# EAGLE design TMR01_v3 (EAGLE 9.2.2)
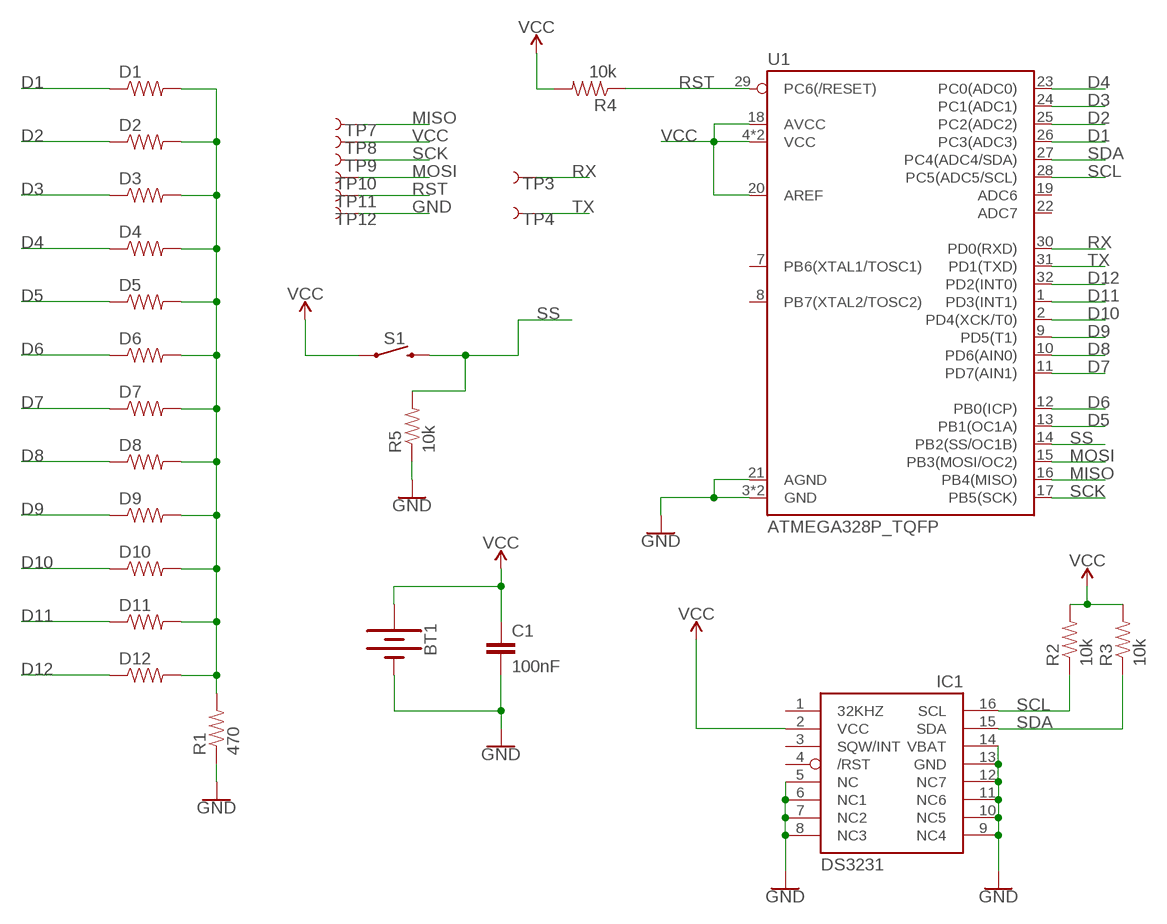
[diagram p0: schematic, sheet 1]

## Parts
BT1  BATTERY-20MM_SMD_4LEGS  [BATTCON_20MM_4LEGS]
C1  100nF  CAP_0402  [0402]
D1  RES_0402  [0402]
D2  RES_0402  [0402]
D3  RES_0402  [0402]
D4  RES_0402  [0402]
D5  RES_0402  [0402]
D6  RES_0402  [0402]
D7  RES_0402  [0402]
D8  RES_0402  [0402]
D9  RES_0402  [0402]
D10  RES_0402  [0402]
D11  RES_0402  [0402]
D12  RES_0402  [0402]
IC1  DS3231/SO  [SO16W]
R1  470  RES_0402  [0402]
R2  10k  RES_0402  [0402]
R3  10k  RES_0402  [0402]
R4  10k  RES_0402  [0402]
R5  10k  RES_0402  [0402]
S1  MOMENTARY-SWITCH-SPST  [TACTILE_SWITCH_PTH_2_AHE]
TP3  TEST-POINT3X4  [PAD.03X.04]
TP4  TEST-POINT3X4  [PAD.03X.04]
TP7  TEST-POINT3X4  [PAD.03X.04]
TP8  TEST-POINT3X4  [PAD.03X.04]
TP9  TEST-POINT3X4  [PAD.03X.04]
TP10  TEST-POINT3X4  [PAD.03X.04]
TP11  TEST-POINT3X4  [PAD.03X.04]
TP12  TEST-POINT3X4  [PAD.03X.04]
U1  ATMEGA328P_TQFP  [TQFP32-08]

## Nets
D1: D1.1 U1.26(PC3(ADC3))
D2: D2.1 U1.25(PC2(ADC2))
D3: D3.1 U1.24(PC1(ADC1))
D4: D4.1 U1.23(PC0(ADC0))
D5: D5.1 U1.13(PB1(OC1A))
D6: D6.1 U1.12(PB0(ICP))
D7: D7.1 U1.11(PD7(AIN1))
D8: D8.1 U1.10(PD6(AIN0))
D9: D9.1 U1.9(PD5(T1))
D10: D10.1 U1.2(PD4(XCK/T0))
D11: D11.1 U1.1(PD3(INT1))
D12: D12.1 U1.32(PD2(INT0))
GND: BT1.NEGATIVE(-) C1.2 IC1.5(NC) IC1.6(NC1) IC1.7(NC2) IC1.8(NC3) IC1.9(NC4) IC1.10(NC5) IC1.11(NC6) IC1.12(NC7) IC1.13(GND) IC1.14(VBAT) R1.1 R5.1 TP12.P$1 U1.3(GND) U1.5(GND) U1.21(AGND)
MISO: TP7.P$1 U1.16(PB4(MISO))
MOSI: TP10.P$1 U1.15(PB3(MOSI/OC2))
N$3: D1.2 D2.2 D3.2 D4.2 D5.2 D6.2 D7.2 D8.2 D9.2 D10.2 D11.2 D12.2 R1.2
RST: R4.1 TP11.P$1 U1.29(PC6(/RESET))
RX: TP3.P$1 U1.30(PD0(RXD))
SCK: TP9.P$1 U1.17(PB5(SCK))
SCL: IC1.16(SCL) R2.1 U1.28(PC5(ADC5/SCL))
SDA: IC1.15(SDA) R3.1 U1.27(PC4(ADC4/SDA))
SS: R5.2 S1.2 U1.14(PB2(SS/OC1B))
TX: TP4.P$1 U1.31(PD1(TXD))
VCC: BT1.POSITIVE@1(+) BT1.POSITIVE@2(+) BT1.POSITIVE@3(+) BT1.POSITIVE@4(+) C1.1 IC1.2(VCC) R2.2 R3.2 R4.2 S1.1 TP8.P$1 U1.4(VCC) U1.6(VCC) U1.18(AVCC) U1.20(AREF)
Unconnected: IC1.1(32KHZ) IC1.3(SQW/INT) IC1.4(/RST) U1.7(PB6(XTAL1/TOSC1)) U1.8(PB7(XTAL2/TOSC2)) U1.19(ADC6) U1.22(ADC7)

## Library data of the parts
BT1 = SparkFun-Batteries:BATTERY: Battery - Single Cell A variety of battery chemistries, sizes, and footprints. Device List: 20MM_PTH - Coin Cell Battery Holder - 20mm (PTH) <https://www.sparkfun.com/products/783> 20MM_PTH_KIT- Coin Cell battery Holder - 20 mm (PTH) <http://www.sparkfun.com/products/783>kit version with special mask 6.8MM_PTH - Coin Cell Battery Holder - 6.8MM(SMD) <https://www.digikey.com/product-detail/en/seiko-instruments/MS621FE-FL11E/728-1057-ND/1889208?WT.srch=1&gclid=CNOQ5a6LzdQCFZS2wAodXCkE0g> 12MM_SMD - Coin Cell Battery Holder - 12mm (SMD) <https://www.sparkfun.com/products/10592> 12MM_PTH - Coin Cell Battery Holder - 12mm (PTH) <https://www.sparkfun.com/products/7948> 20MM_SMD - 20mm Coin Cell Battery Holder (SMD) (2 legs) Used on the Big Time Watch Kit <https://www.sparkfun.com/products/11734> 20MM_SMD_4LEGS - Coin Cell Battery Holder - 20mm (SMD) <https://www.sparkfun.com/products/11892> 20MM_SMD_4LEGS_OVERPASTE - Coin Cell Battery Holder - 20mm (SMD) <https://www.sparkfun.com/products/11892> (Over-paste on the legs) 24.5MM_PTH - Coin Cell Battery Holder - 24.5mm (PTH) <https://www.sparkfun.com/products/8863> 9V - 9V Battery Holder - PC Mount Used on the SparkFun SparkPunk Sound Kit <https://www.sparkfun.com/products/11177> and SparkFun SparkPunk Sequencer Kit <https://www.sparkfun.com/products/12707> 18650 - Battery Holder - 18650 (PTH) <https://www.sparkfun.com/products/13113> AA - Battery Holder - 1xAA (PTH) <https://www.sparkfun.com/products/7949> AAA - Battery Holder - 1xAAA (PTH) <https://www.sparkfun.com/products/12718> AA_KIT - Battery Holder - 1xAA (PTH) <https://www.sparkfun.com/products/7949> Special kit package - pads only have exposed copper on one side of the board. AAA_KIT - Battery Holder - 1xAAA (PTH) <https://www.sparkfun.com/products/12718> Special kit package - pads only have exposed copper on one side of the board.; PROD_ID: BATT-10373; SF_SKU: PRT-11892
C1 = Perfect_0402:CAP_0402: 0402 (1005 Metric) Nick Garner - TeleSense
D1-D12 R1-R5 = Perfect_0402:RES_0402: 0402 (1005 Metric) Nick Garner - TeleSense
IC1 = adafruit:DS3231
S1 = SparkFun-Switches:MOMENTARY-SWITCH-SPST: Momentary Switch (Pushbutton) - SPST Normally-open (NO) SPST momentary switches (buttons, pushbuttons). Variants PTH-12MM - 12mm square, through-hole Momentary Pushbutton Switch - 12mm Square <https://www.sparkfun.com/products/9190> (COM-09190) PTH-6.0MM, PTH-6.0MM-KIT - 6.0mm square, through-hole Mini Pushbutton Switch <https://www.sparkfun.com/products/97> (COM-00097) KIT package intended for soldering kit's - only one side of pads' copper is exposed. PTH-RIGHT-ANGLE-KIT - Right-angle, through-hole Right Angle Tactile Button <https://www.sparkfun.com/products/10791> - Used on SparkFun BigTime Watch Kit <https://www.sparkfun.com/products/11734> SMD-12MM - 12mm square, surface-mount Tactile Button - SMD (12mm) <https://www.sparkfun.com/products/12993> (COM-12993) Used on SparkFun PicoBoard <https://www.sparkfun.com/products/11888> SMD-4.5MM - 4.5mm Square Trackball Switch Used on SparkFun Blackberry Trackballer Breakout <https://www.sparkfun.com/products/13169> SMD-4.6MMX2.8MM - 4.60mm x 2.80mm, surface mount Used on SparkFun SAMD21 Mini Breakout <https://www.sparkfun.com/products/13664> SMD-5.2MM, SMD-5.2-REDUNDANT - 5.2mm square, surface-mount Mini Pushbutton Switch - SMD <https://www.sparkfun.com/products/8720> (COM-08720) Used on Arduino Pro Mini <https://www.sparkfun.com/products/11114> REDUNDANT package connects both switch circuits together SMD-6.0X3.5MM - 6.0 x 3.5mm, surface mount Momentary Reset Switch SMD <https://www.sparkfun.com/products/8229> (COM-08229) SMD-6.2MM-TALL - 6.2mm square, surface mount Tactile Button - SMD (6mm) <https://www.sparkfun.com/products/12992> Used on SparkFun Digital Sandbox <https://www.sparkfun.com/products/12651> SMD-RIGHT-ANGLE - Right-angle, surface mount Used on SparkFun Block for Intel® Edison - Arduino <https://www.sparkfun.com/products/13036>
TP3 TP4 TP7-TP12 = SparkFun-Connectors:TEST-POINT: SparkFun Test Points Bare copper test points for troubleshooting or In-Circuit-Testing. These are used by our Production team for verifying production board runs using pogo-pins on test beds. SparkFun Products: SparkFun LSM9DS1 Breakout <https://www.sparkfun.com/products/13284> SparkFun PSOC <https://www.sparkfun.com/products/13714> SparkFun Load Cell Amplifier <https://www.sparkfun.com/products/13879>
U1 = SparkFun-IC-Microcontroller:ATMEGA328P_TQFP: Popular 328P in QFP Storefront component: ATmega328 - TQFP <https://www.sparkfun.com/products/13448> (COM-13448) Datasheet <http://www.sparkfun.com/datasheets/Components/SMD/ATMega328.pdf> SparkFun Products SparkFun RedBoard - Programmed with Arduino <https://www.sparkfun.com/products/12757> (DEV-12757) Arduino Pro Mini 328 - 5V/16MHz <https://www.sparkfun.com/products/11113> (DEV-11113) Arduino Pro Mini 328 - 3.3V/8MHz <https://www.sparkfun.com/products/11114> (DEV-11114) SparkFun OpenLog <https://www.sparkfun.com/products/13712> (DEV-13712) SparkFun MicroView - OLED Arduino Module <https://www.sparkfun.com/products/12923> (DEV-12923) SparkFun Digital Sandbox <https://www.sparkfun.com/products/12651> (DEV-12651) SparkFun PicoBoard <https://www.sparkfun.com/products/11888> (WIG-11888) Arduino Fio <https://www.sparkfun.com/products/10116> (DEV-10116) LilyPad Arduino 328 Main Board <https://www.sparkfun.com/products/13342> (DEV-13342) SparkFun RedStick <https://www.sparkfun.com/products/13741> (DEV-13741) LilyPad MP3 <https://www.sparkfun.com/products/11013> (DEV-11013) LilyPad Arduino SimpleSnap <https://www.sparkfun.com/products/10941> (DEV-10941) SparkFun Stepoko <https://www.sparkfun.com/products/13899> (ROB-13899) SparkFun Geiger Counter <https://www.sparkfun.com/products/11345> (SEN-11345) SparkFun EL Sequencer <https://www.sparkfun.com/products/12781> (COM-12781) Arduino Pro 328 - 5V/16MHz <https://www.sparkfun.com/products/10915> (DEV-10915) CryptoCape <https://www.sparkfun.com/products/12773> (DEV-12773) SparkFun IR Thermometer Evaluation Board - MLX90614 <https://www.sparkfun.com/products/10740> (SEN-10740) SparkFun RedBot Mainboard <https://www.sparkfun.com/products/12097> (ROB-12097) Arduino Pro 328 - 3.3V/8MHz <https://www.sparkfun.com/products/10914> (DEV-10914) SparkFun Block for Intel® Edison - Arduino <https://www.sparkfun.com/products/13036> (DEV-13036) SparkFun Simon Says - Surface Mount Soldering Kit <https://www.sparkfun.com/products/10935> (KIT-10935) SparkFun 7-Segment Serial Display - Red <https://www.sparkfun.com/products/11441> (COM-11441) SparkFun 7-Segment Serial Display - White <https://www.sparkfun.com/products/11629> (COM-11629) SparkFun 7-Segment Serial Display - Yellow <https://www.sparkfun.com/products/11443> (COM-11443) SparkFun 7-Segment Serial Display - Kelly Green <https://www.sparkfun.com/products/11440> (COM-11440) SparkFun 7-Segment Serial Display - Blue <https://www.sparkfun.com/products/11442> (COM-11442) SparkFun OpenSegment Serial Display - 20mm (Blue) <https://www.sparkfun.com/products/11647> (COM-11647) SparkFun OpenSegment Serial Display - 20mm (Green) <https://www.sparkfun.com/products/11646> (COM-11646) SparkFun OpenSegment Serial Display - 20mm (White) <https://www.sparkfun.com/products/11648> (COM-11648) SparkFun OpenSegment Serial Display - 20mm (Red) <https://www.sparkfun.com/products/11644> (COM-11644) SparkFun OpenSegment Serial Display - 20mm (Yellow) <https://www.sparkfun.com/products/11645> (COM-11645) SparkFun OpenSegment Shield <https://www.sparkfun.com/products/13190> (DEV-13190); PROD_ID: IC-09069

## Board
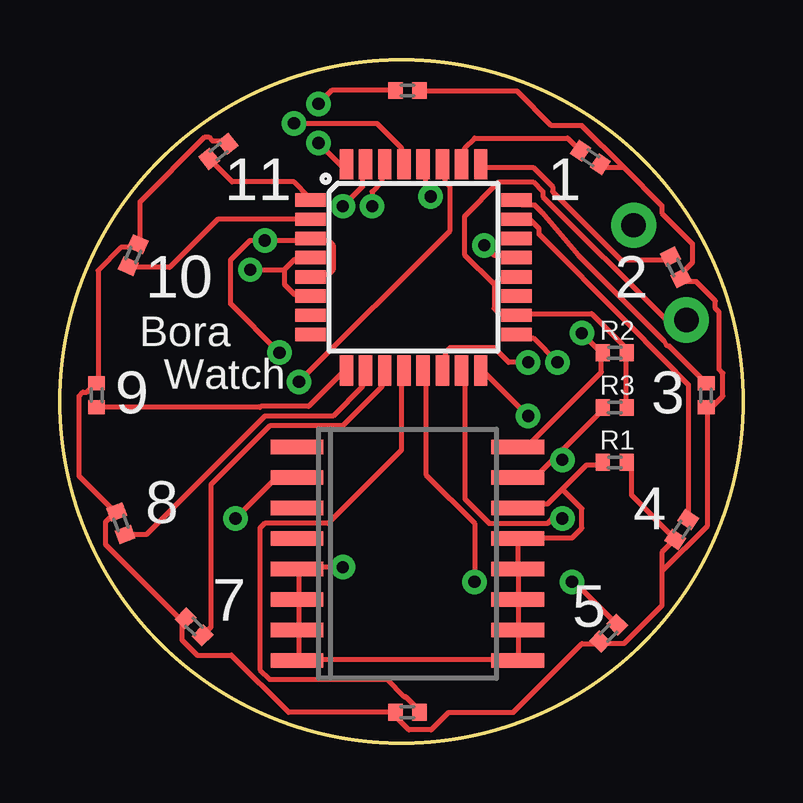
[diagram p1: board, top side]
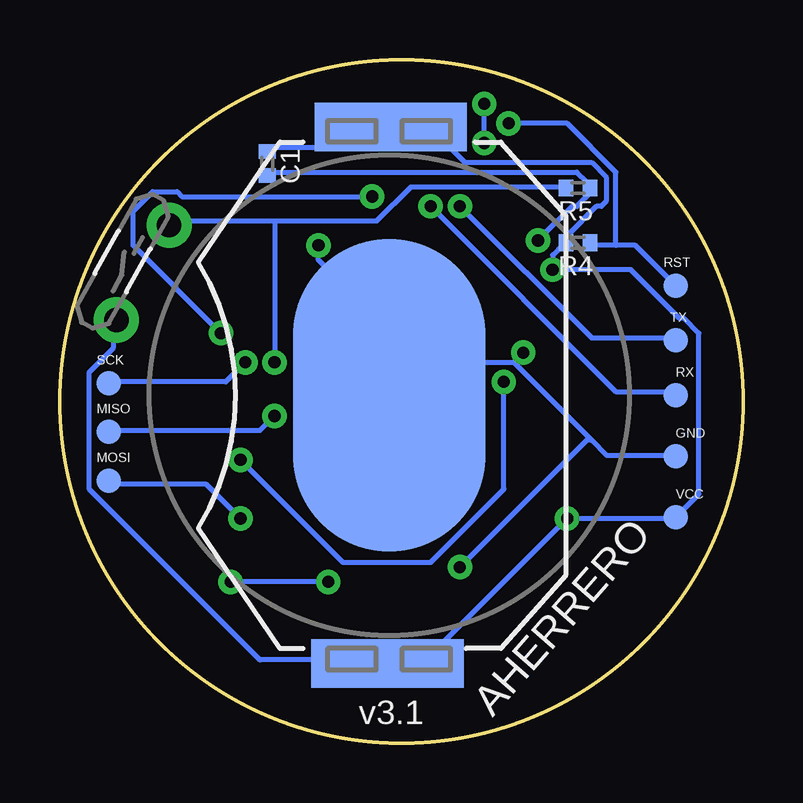
[diagram p2: board, bottom side, seen from below]

Size 28.45 x 28.45 mm. Coordinates in mm from the lower left corner, seen from the top.
Outline: circle at 14.22,14.22 radius 14.22
Copper layers (1*16): Top 0.035mm / dielectric 1.5mm / Bottom 0.035mm
Design rules "SparkFun": minimum track width 8mil, minimum drill 20mil, track to track 8mil, track to pad 8mil, pad to pad 8mil, via to via 8mil, smd to smd 8mil, copper to edge 8mil, drill to drill 8mil, minimum pad ring 12mil, minimum via ring 10mil, stop-mask expansion 4mil, vias tented up to drill 20mil, thermal gap 10mil

### Footprints (pad centres in the part's own frame; a part is rotated, then mirrored left to right if it is on the bottom)
BATTCON_20MM_4LEGS = smd 13 x 8: NEGATIVE 0,0 | smd 2.032 x 3.175: POSITIVE@1 -11.176,1.651; POSITIVE@2 -11.176,-1.524; POSITIVE@3 11.176,1.524; POSITIVE@4 11.176,-1.651
0402 = smd 0.6 x 0.7: 1 -0.5,0; 2 0.5,0
SO16W = smd 0.6 x 2.2: 1 -4.445,-4.6; 2 -3.175,-4.6; 3 -1.905,-4.6; 4 -0.635,-4.6; 5 0.635,-4.6; 6 1.905,-4.6; 7 3.175,-4.6; 8 4.445,-4.6; 9 4.445,4.6; 10 3.175,4.6; 11 1.905,4.6; 12 0.635,4.6; 13 -0.635,4.6; 14 -1.905,4.6; 15 -3.175,4.6; 16 -4.445,4.6
TACTILE_SWITCH_PTH_2_AHE = drill 1.016 pad 1.88: 1 -0.457,2.261; 2 -0.457,-2.261
PAD.03X.04 = smd 1.016 x 1.016: P$1 0,0
TQFP32-08 = smd 1.27 x 0.559: 1 -4.293,2.8; 2 -4.293,2; 3 -4.293,1.2; 4 -4.293,0.4; 5 -4.293,-0.4; 6 -4.293,-1.2; 7 -4.293,-2; 8 -4.293,-2.8; 17 4.293,-2.8; 18 4.293,-2; 19 4.293,-1.2; 20 4.293,-0.4; 21 4.293,0.4; 22 4.293,1.2; 23 4.293,2; 24 4.293,2.8 | smd 0.559 x 1.27: 9 -2.8,-4.293; 10 -2,-4.293; 11 -1.2,-4.293; 12 -0.4,-4.293; 13 0.4,-4.293; 14 1.2,-4.293; 15 2,-4.293; 16 2.8,-4.293; 25 2.8,4.293; 26 2,4.293; 27 1.2,4.293; 28 0.4,4.293; 29 -0.4,4.293; 30 -1.2,4.293; 31 -2,4.293; 32 -2.8,4.293

### Placement (x,y rotation side)
BT1  14.73,14.48 270 bottom
C1  19.81,24.13 270 bottom
D1  22.1,24.38 326.3 top
D2  25.65,19.81 296.5 top
D3  26.92,14.48 270 top
D4  25.91,8.89 236.3 top
D5  22.86,4.57 225 top
D6  14.48,1.27 180 top
D7  5.59,4.83 135 top
D8  2.54,9.14 110.2 top
D9  1.52,14.48 90 top
D10  3.05,20.32 66.3 top
D11  6.6,24.64 38.7 top
D12  14.48,27.18 0 top
IC1  14.48,7.87 270 top
R1  23.11,11.68 0 top
R2  23.11,16.26 0 top
R3  23.11,13.97 0 top
R4  6.86,20.83 180 bottom
R5  6.86,23.11 180 bottom
S1  25.4,19.81 150.9 bottom
TP3  2.79,14.48 0 bottom
TP4  2.79,16.76 0 bottom
TP7  26.42,12.95 180 bottom
TP8  2.79,9.4 0 bottom
TP9  26.42,14.99 0 bottom
TP10  26.42,10.92 0 bottom
TP11  2.79,19.05 0 bottom
TP12  2.79,11.94 0 bottom
U1  14.73,19.81 0 top

### Tracks (layer width: path | path; a pad name or v marks a point on that pad's centre or on a via)
D1
  Top 0.203: U1.26 16.87,24.18 16.87,24.79 17.27,25.2 21.15,25.2 D1.1
D2
  Top 0.203: U1.25 17.68,23.98 19.71,23.98 20.52,23.16 20.52,22.96 23.37,20.12 25.29,20.12 D2.1
D3
  Top 0.203: U1.24 19.24,22.4 19.79,22.4 19.96,22.22 19.96,22.2 20.07,22.1 21.59,20.32 25.15,16.76 25.26,16.56 25.39,16.52 D3.1
D4
  Top 0.203: U1.23 19.1,21.74 19.56,21.84 19.56,21.82 19.96,21.42 19.96,21.18 23.62,17.53 25.13,15.98 26.18,14.93 D4.1
D5  (via drill 0.51)
  Top 0.203: v17.27,6.71 17.27,9.14 15.24,11.18 15.24,15.44 U1.13 | D5.1 21.43,6.71 v21.34,6.71
  Bottom 0.203: v17.27,6.71 v21.34,6.71
D6
  Top 0.203: U1.12 14.22,15.44 14.22,12.19 11.18,9.14 8.53,9.14 8.33,8.94 8.33,3.05 8.74,2.64 13.61,2.64 14.33,1.93 14.4,1.93 14.98,1.35 D6.1
D7
  Top 0.203: U1.11 13.41,15.44 13.41,14.83 11.79,13.21 8.74,13.21 6.3,10.77 6.3,4.83 D7.1
D8
  Top 0.203: U1.10 12.6,15.44 12.6,14.83 11.38,13.61 8.53,13.61 3.6,8.68 D8.1
D9
  Top 0.203: U1.9 11.79,15.44 10.36,14.02 8.37,14.02 8.32,13.98 D9.1
D10
  Top 0.203: U1.2 6.57,21.81 4.57,19.81 2.9,19.81 D10.1
D11
  Top 0.203: U1.1 10.36,22.76 9.75,23.37 7.17,23.37 D11.1
D12  (via drill 0.51)
  Top 0.203: v10.77,24.99 11.79,23.98 U1.32 | D12.1 11.33,27.18 v10.77,26.62
  Bottom 0.203: v10.77,24.99 v10.77,26.62
GND  (via drill 0.51)
  Top 0.203: 9.96,3.45 9.96,4.67 IC1.7 9.96,4.88 9.96,5.89 IC1.6 9.96,6.1 9.96,7.11 IC1.5 9.96,7.32 v11.79,7.32 | 20.93,10.57 20.32,9.96 19.1,9.96 IC1.14 | 20.93,10.57 21.95,11.58 22.55,11.58 R1.1 | 20.93,10.57 21.74,9.75 21.74,8.94 21.34,8.53 19.1,8.53 IC1.13 19.1,8.33 19.1,7.32 IC1.12 19.1,7.11 19.1,6.1 IC1.11 19.1,5.89 19.1,4.88 IC1.10 19.1,4.67 19.1,3.45 IC1.9 18.9,3.45 9.96,3.45 | 9.96,3.45 IC1.8 | U1.5 10.57,19.51 11.18,19.51 11.38,19.71 11.38,20.73 11.18,20.93 10.57,20.93 U1.3 10.36,20.93 v8.53,20.93 7.92,20.93 7.11,20.12 7.11,18.29 v9.14,16.26 | v17.68,20.73 18.09,20.32 18.9,20.32 U1.21
  Bottom 0.203: C1.2 19.71,23.77 6.91,23.77 6.5,23.37 6.5,23.16 R5.1 6.3,22.96 6.91,22.35 7.11,22.35 v8.53,20.93 | 9.55,15.85 6.3,12.6 | 6.3,12.6 5.69,11.99 2.85,11.99 TP12.P$1 | 13.41,15.85 9.55,15.85 | 13.41,15.85 14.63,14.63 BT1.NEGATIVE 13.41,15.85 | v17.68,20.73 17.68,20.12 13.41,15.85 | 9.55,15.85 v9.14,16.26 | v11.79,7.32 6.5,12.6 6.3,12.6
MISO  (via drill 0.51)
  Top 0.203: v19.51,13.61 17.68,15.44 U1.16
  Bottom 0.203: v19.51,13.61 20.12,13.01 26.42,13.01 TP7.P$1
MOSI  (via drill 0.51)
  Top 0.203: v20.93,9.35 20.52,9.35 20.32,9.14 17.88,9.14 16.87,10.16 16.87,15.44 U1.15
  Bottom 0.203: v20.93,9.35 22.35,10.77 26.42,10.77 TP10.P$1
N$3
  Top 0.203: 23.5,23.97 25.08,22.38 25.08,22.07 26.35,20.8 26.35,20 26.04,19.68 26.04,19.37 D2.2 26.04,19.21 26.51,19.21 27.3,18.41 27.3,18.1 27.46,17.94 27.46,15.56 27.62,15.4 27.62,14.45 26.99,13.81 | 23.5,23.97 22.54,23.97 D1.2 | 23.5,23.97 21.75,25.72 20.48,25.72 19.05,27.15 15.08,27.15 D12.2 | D11.2 6.99,25.08 6.35,25.08 6.19,25.24 6.03,25.24 3.33,22.54 3.33,20.8 D10.2 3.17,20.64 2.54,20.64 1.59,19.68 1.59,15.08 D9.2 1.43,14.92 1.11,14.61 0.95,14.61 0.79,14.45 0.79,11.11 2.22,9.68 D8.2 2.22,9.53 1.91,9.21 1.91,8.26 5.08,5.08 | 25.08,7.14 25.08,7.94 25.56,8.41 D4.2 25.56,8.57 23.81,10.32 23.81,11.59 R1.2 | 25.08,7.14 25.08,5.71 23.5,4.13 22.54,4.13 D5.2 22.38,4.13 21.75,4.13 18.89,1.27 16.19,1.27 15.46,0.54 14.54,0.54 13.81,1.27 | 26.99,13.81 26.99,9.05 25.08,7.14 | 26.99,13.81 26.99,13.97 D3.2 26.99,13.81 | 13.81,1.27 9.53,1.27 7.14,3.65 5.71,3.65 5.08,4.29 5.08,5.08 | 5.08,5.08 D7.2 | D6.2 13.81,1.27
RST  (via drill 0.51)
  Top 0.203: v9.75,25.81 13.21,25.81 14.22,24.79 14.22,24.18 U1.29
  Bottom 0.203: 5.28,20.73 4.47,20.73 TP11.P$1 | 5.28,20.73 6.3,20.73 R4.1 | v9.75,25.81 7.32,25.81 5.28,23.77 5.28,20.73
RX  (via drill 0.51)
  Top 0.203: v13.01,22.35 13.01,22.96 13.41,23.37 13.41,23.98 U1.30
  Bottom 0.203: v13.01,22.35 5.28,14.63 2.85,14.63 TP3.P$1
SCK  (via drill 0.51)
  Top 0.203: v20.73,15.85 19.71,16.87 19.1,16.87 U1.17
  Bottom 0.203: v20.73,15.85 21.54,15.04 26.42,15.04 TP9.P$1
SCL  (via drill 0.51)
  Top 0.203: 22.55,16.26 22.55,15.44 19.51,12.39 19.1,12.39 IC1.16 | v15.44,22.76 15.24,22.96 15.24,23.98 U1.28 | 22.55,16.26 v21.74,17.07 | 22.55,16.26 R2.1
  Bottom 0.203: v15.44,22.76 23.37,22.76 23.57,22.96 24.59,22.96 25.4,22.15 25.4,20.73 v21.74,17.07
SDA  (via drill 0.51)
  Top 0.203: 20.73,11.99 19.91,11.18 19.1,11.18 IC1.15 | 20.73,11.99 22.55,13.82 R3.1 | v9.96,15.04 16.26,21.34 16.26,23.16 16.05,23.37 16.05,23.98 U1.27 | 20.73,11.99 v20.93,11.79
  Bottom 0.203: v9.96,15.04 9.96,10.57 13.01,7.52 16.66,7.52 v20.93,11.79
SS  (via drill 0.51)
  Top 0.203: v19.51,15.85 18.69,15.85 18.09,16.46 16.26,16.46 16.05,16.26 16.05,15.65 U1.14
  Bottom 0.203: 19.51,21.74 23.77,21.74 S1.2 | 19.51,21.74 15.24,21.74 13.82,23.16 7.52,23.16 R5.2 | 19.51,21.74 v19.51,15.85
TX  (via drill 0.51)
  Top 0.203: v11.79,22.35 12.6,23.16 12.6,23.98 U1.31
  Bottom 0.203: v11.79,22.35 6.3,16.87 2.85,16.87 TP4.P$1
VCC  (via drill 0.51)
  Top 0.203: 9.35,19.71 9.35,19.1 9.75,18.69 10.36,18.69 U1.6 | 9.35,19.71 9.75,20.12 10.36,20.12 U1.4 | v7.92,19.71 9.35,19.71 | 23.57,16.26 23.57,14.02 R3.2 | 18.09,19.1 18.09,18.09 18.29,17.88 18.9,17.88 U1.18 19.1,17.88 22.15,17.88 23.57,16.46 23.57,16.26 | 18.09,19.1 18.29,19.3 18.9,19.3 U1.20 | 23.57,16.26 R2.2 | 18.09,19.1 16.87,20.32 16.87,21.95 18.29,23.37 19.71,23.37 20.12,22.96 20.12,22.76 25.2,17.68 26.01,17.68 S1.1 | v7.32,9.35 8.94,10.97 9.75,10.97 IC1.2
  Bottom 0.203: 16.26,25.6 17.07,24.79 19.71,24.79 C1.1 | 16.26,25.6 13.21,25.6 BT1.POSITIVE@1 13.01,25.6 11.58,24.18 6.3,24.18 5.69,23.57 5.69,22.55 5.89,22.35 6.1,22.35 7.32,21.13 7.32,20.93 R4.2 7.52,20.73 7.92,20.32 v7.92,19.71 4.67,19.71 2.64,17.68 2.44,17.68 1.83,17.07 1.83,10.36 TP8.P$1 2.85,9.35 v7.32,9.35 13.21,3.45 BT1.POSITIVE@3 13.21,3.25 16.26,3.25 BT1.POSITIVE@4 16.46,3.45 20.12,3.45 27.23,10.57 27.23,15.44 26.21,16.46 26.21,17.48 S1.1 | 16.26,25.6 BT1.POSITIVE@2

### Text on the board
tPlace: 11 | 1 | 10 | 2 | Bora | Watch | 9 | 3 | 8 | 4 | 7 | 5
bPlace: RST | TX | SCK | RX | MISO | GND | MOSI | VCC | AHERRERO | v3.1